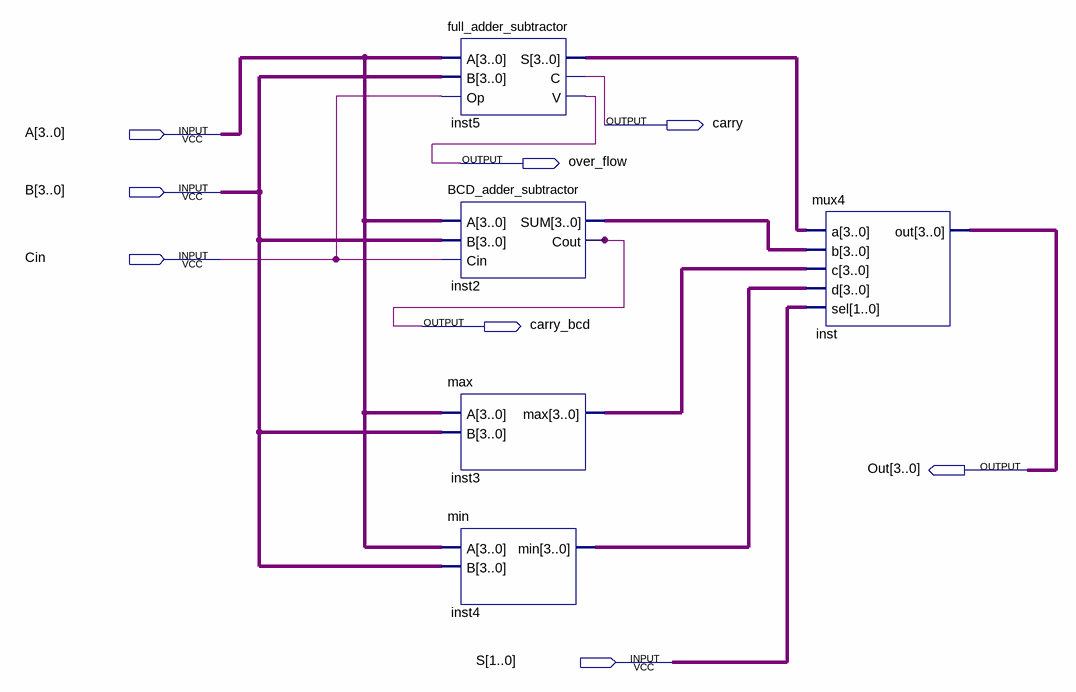
[diagram p0: schematic sheet]
// Quartus schematic all.bdf as structural Verilog: 5 symbols, 8 pins
module all (
  input  [3:0] A,
  input  [3:0] B,
  input  Cin,
  input  [1:0] S,
  output carry,
  output over_flow,
  output carry_bcd,
  output [3:0] Out
);

  wire [3:0] inst2_sum, inst3_max, inst4_min, inst5_s;

  full_adder_subtractor inst5 (.A(A), .B(B), .Op(Cin), .S(inst5_s), .C(carry), .V(over_flow));
  BCD_adder_subtractor inst2 (.A(A), .B(B), .Cin(Cin), .SUM(inst2_sum), .Cout(carry_bcd));
  max inst3 (.A(A), .B(B), .max(inst3_max));
  min inst4 (.A(A), .B(B), .min(inst4_min));
  mux4 inst (.a(inst5_s), .b(inst2_sum), .c(inst3_max), .d(inst4_min), .sel(S), .out(Out));
endmodule
